# Altium project function generator.PrjPcb
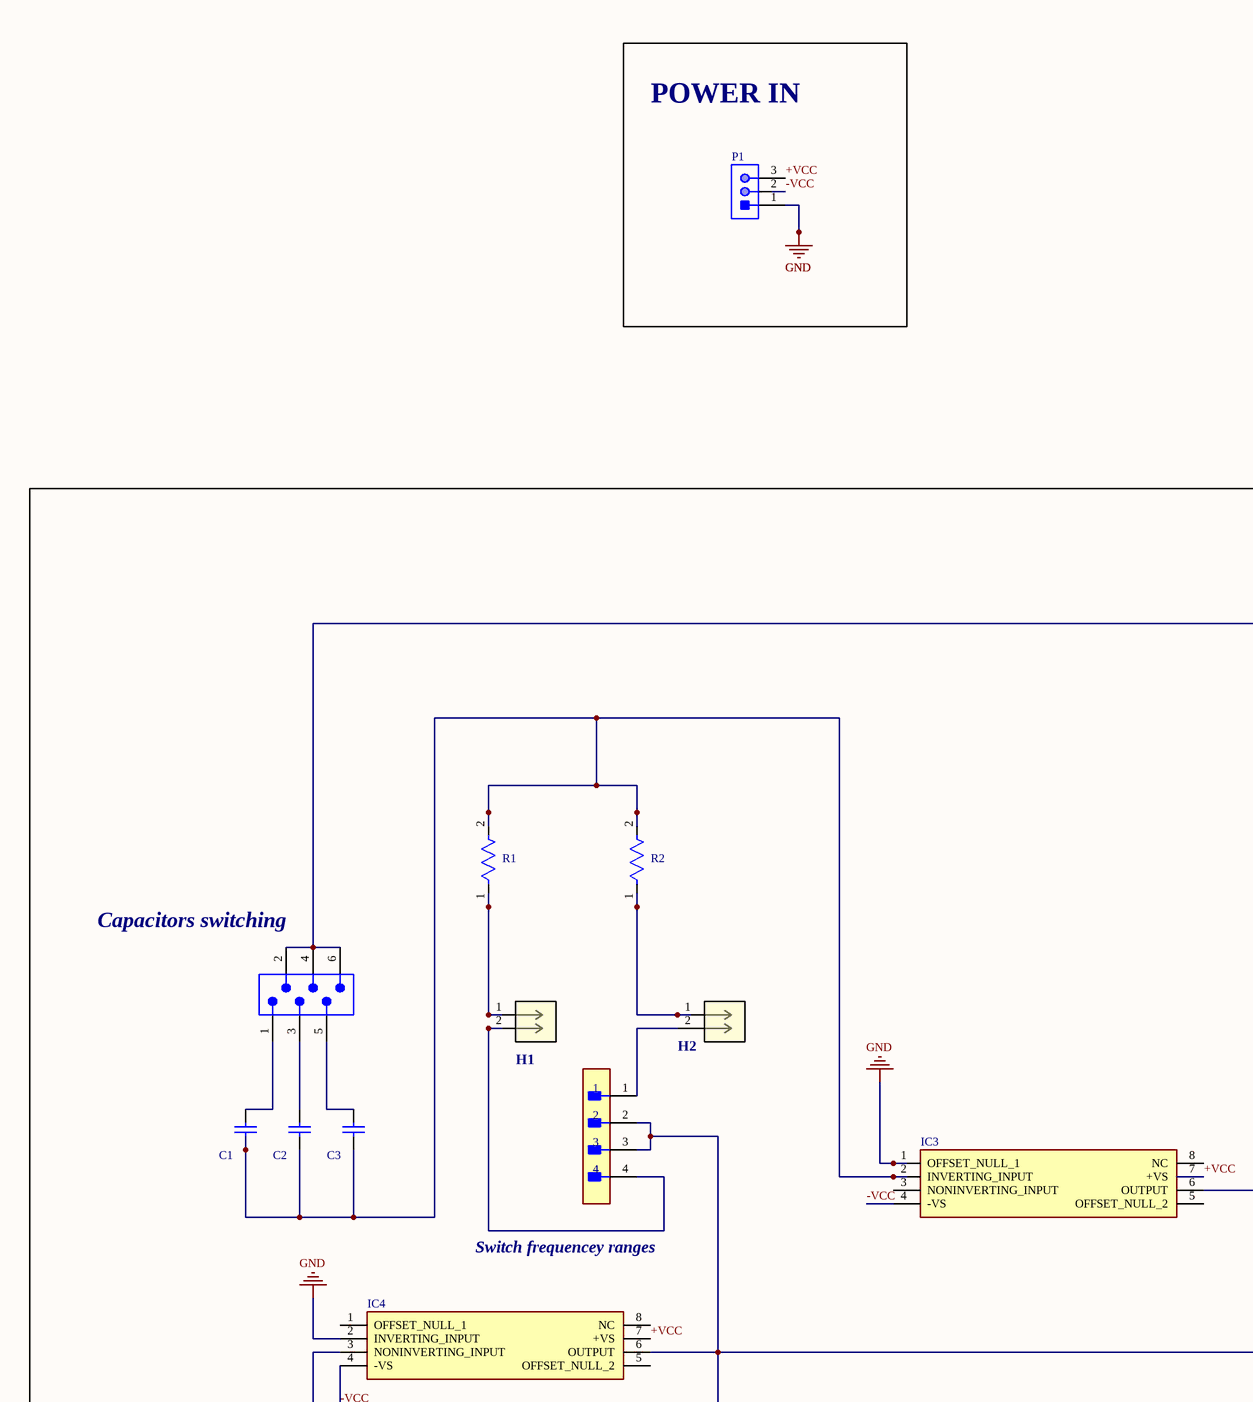
[diagram p0: FG Sce.SchDoc, top left]
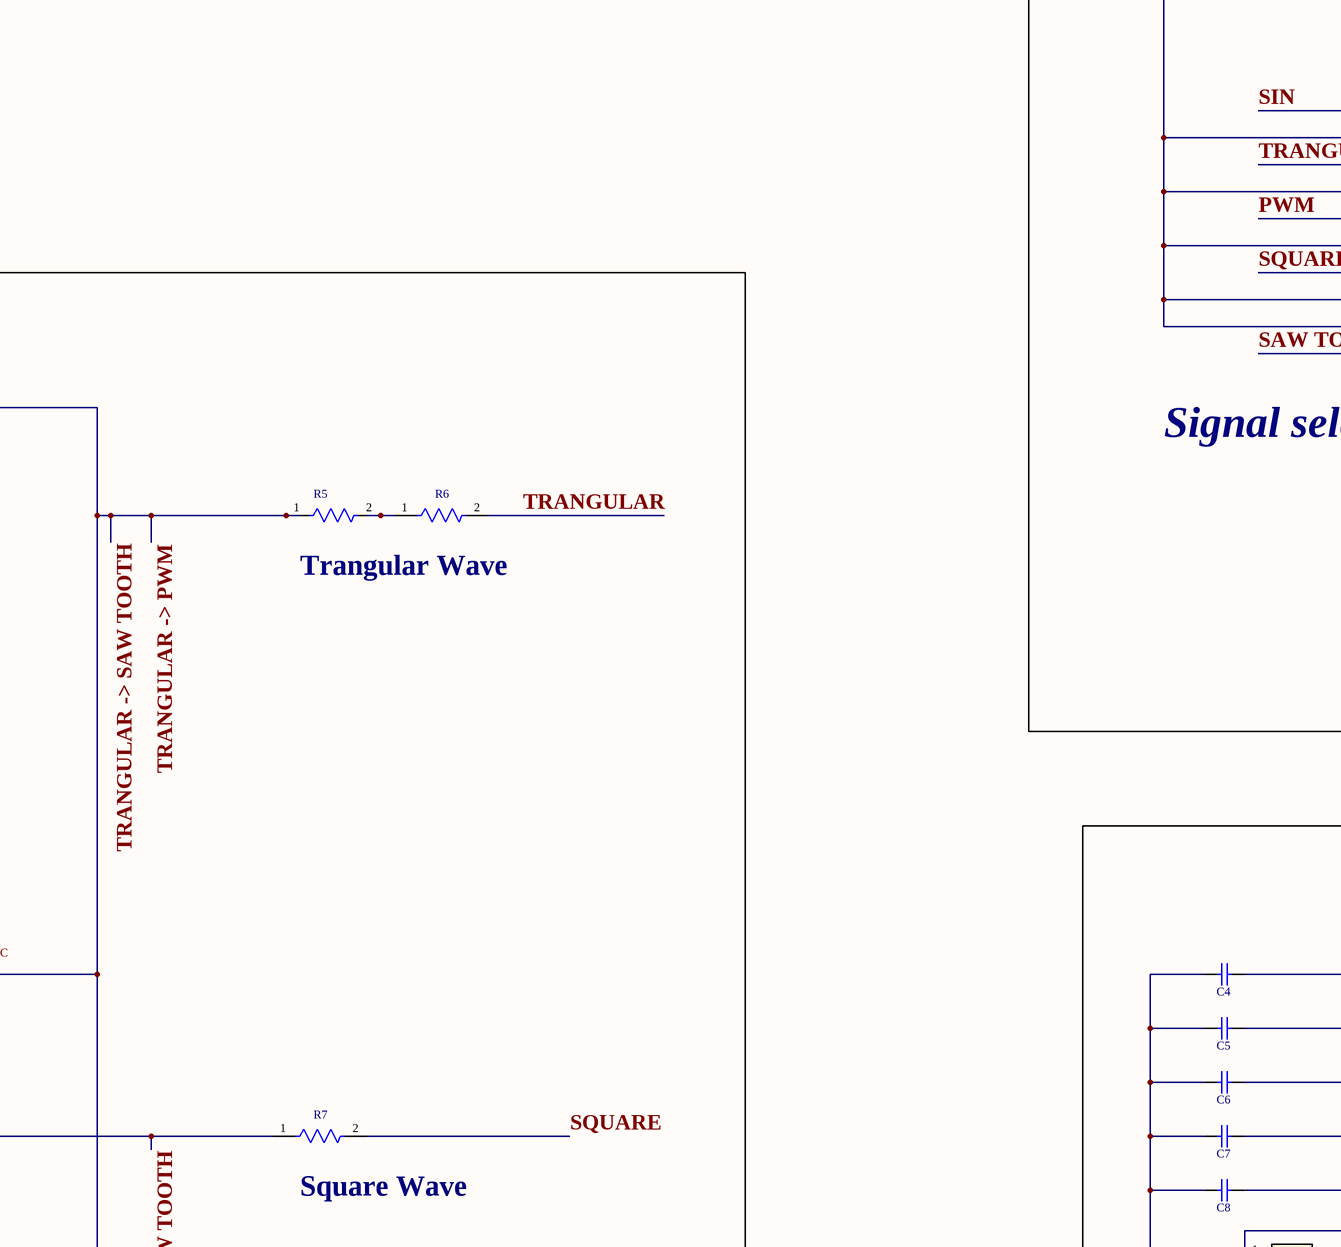
[diagram p1: FG Sce.SchDoc, top middle]
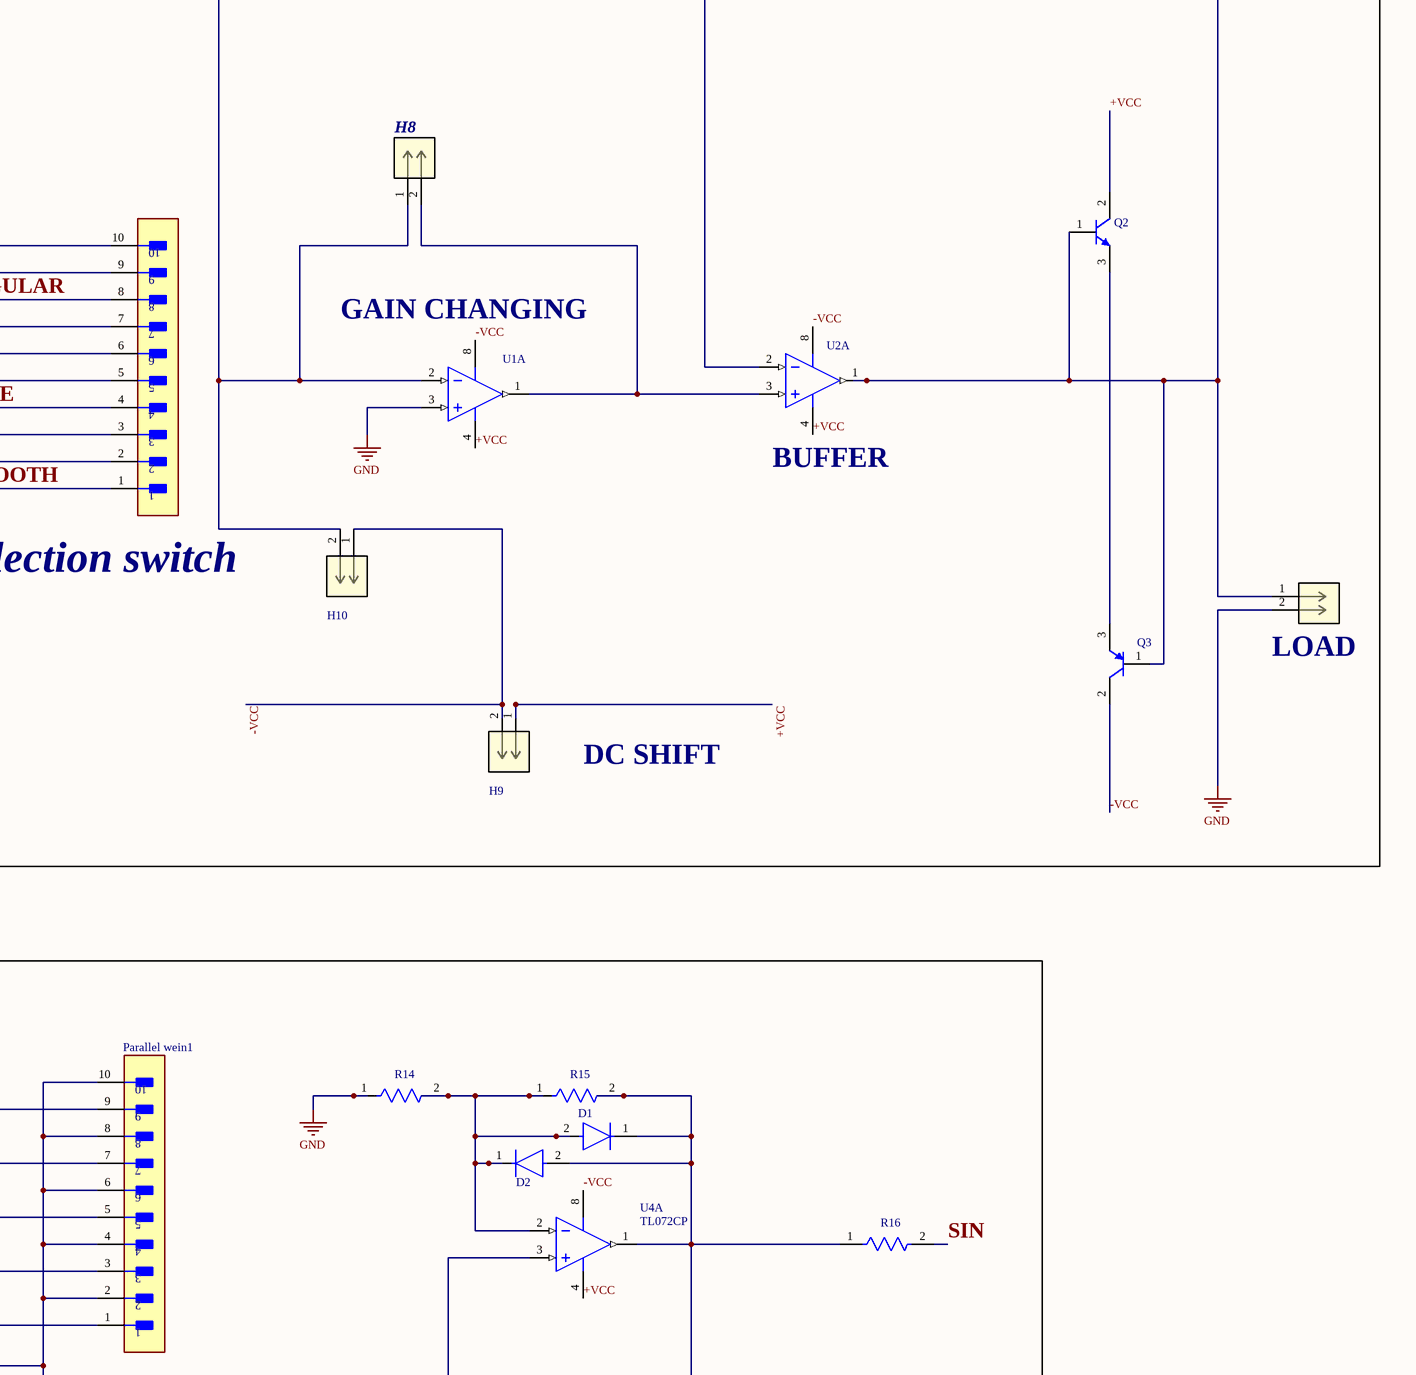
[diagram p2: FG Sce.SchDoc, top right]
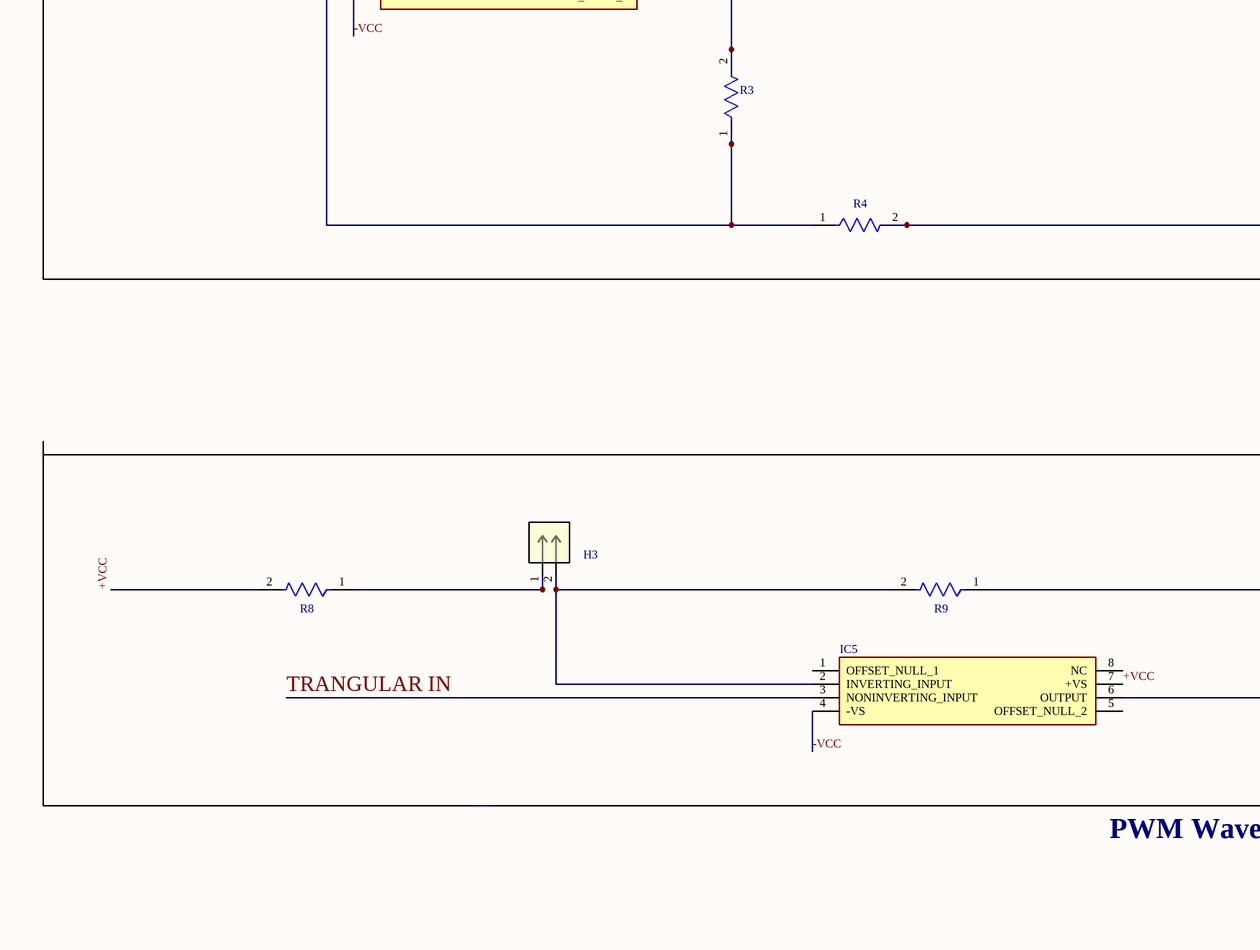
[diagram p3: FG Sce.SchDoc, bottom left]
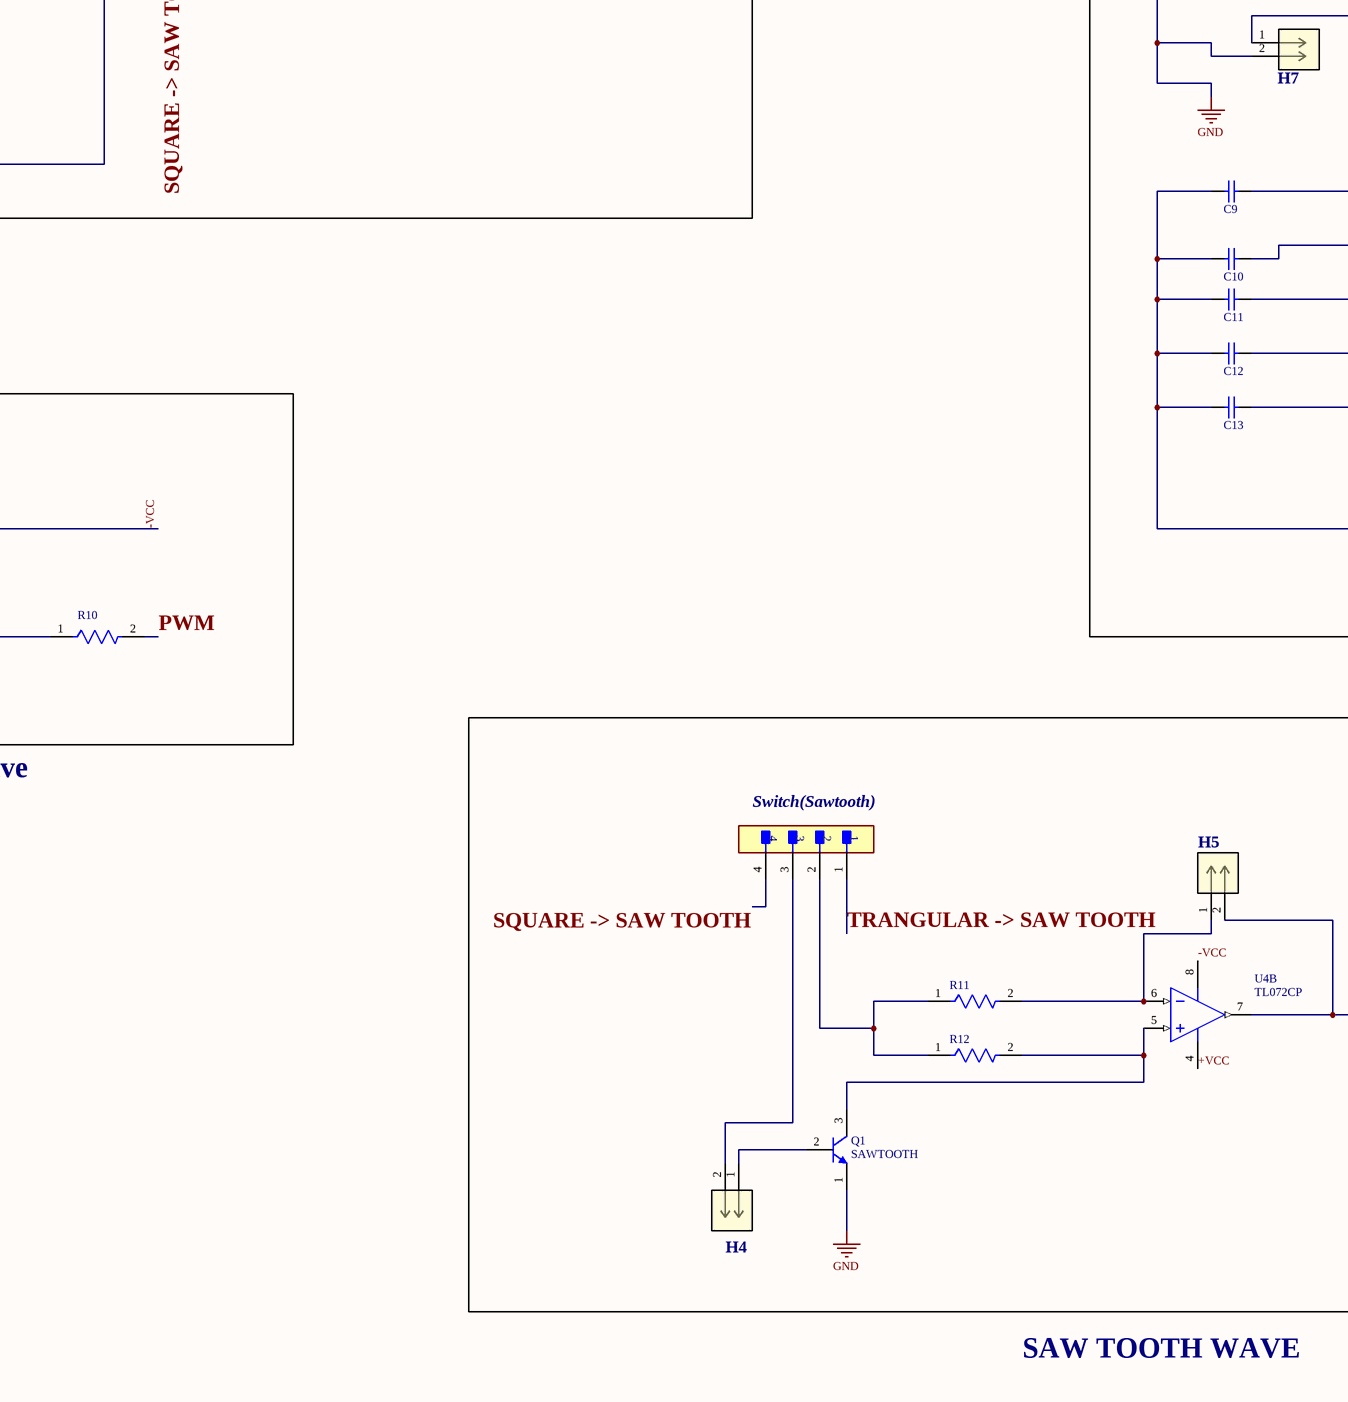
[diagram p4: FG Sce.SchDoc, bottom middle]
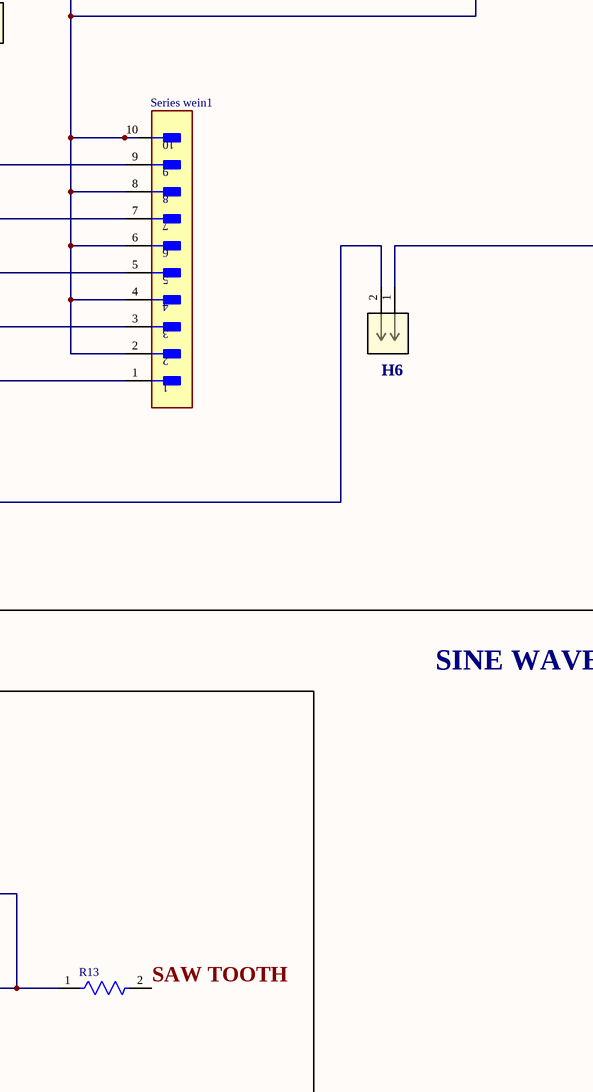
[diagram p5: FG Sce.SchDoc, bottom right]
1 sheet, 58 parts. Net scope: global (net labels, ports and power ports of the same name join across sheets).
Board file: PCB1.PcbDoc

## Sheet FG Sce.SchDoc
size A1; SheetNumber: 1; SheetTotal: 1

### Parts
C1  1uF  [KEMT-C333C105M5U5TA-2]  (value not drawn)
C2  0.1uF  [KEMT-C333C105M5U5TA-2]  (value not drawn)
C3  0.01uF  [KEMT-C333C105M5U5TA-2]  (value not drawn)
C4  10uF  [KEMT-C333C105M5U5TA-2]  (value not drawn)
C5  1uF  [KEMT-C333C105M5U5TA-2]  (value not drawn)
C6  100nF  [KEMT-C333C105M5U5TA-2]  (value not drawn)
C7  10nF  [KEMT-C333C105M5U5TA-2]  (value not drawn)
C8  1nF  [KEMT-C333C105M5U5TA-2]  (value not drawn)
C9  10uF  [KEMT-C333C105M5U5TA-2]  (value not drawn)
C10  1uF  [KEMT-C333C105M5U5TA-2]  (value not drawn)
C11  100nF  [KEMT-C333C105M5U5TA-2]  (value not drawn)
C12  10nF  [KEMT-C333C105M5U5TA-2]  (value not drawn)
C13  1nF  [KEMT-C333C105M5U5TA-2]  (value not drawn)
Capacitors_switching  690357100672  [690357100672]  (value not drawn)
D1  1N4148  [FP-017AG-MFG]  (value not drawn)
D2  1N4148  [FP-017AG-MFG]  (value not drawn)
H1  10KOHM POTENTIOMETER  [2Pins_AMP]  (value not drawn)
H2  200KOHM POTENTIOMETER  [2Pins_AMP]  (value not drawn)
H3  5Kohm Potentiometer  [2Pins_AMP]  (value not drawn)
H4  100KOHM POTENTIOMETER  [2Pins_AMP]  (value not drawn)
H5  10Kohm potentiometer  [2Pins_AMP]  (value not drawn)
H6  10Kohm potentiometer  [2Pins_AMP]  (value not drawn)
H7  10Kohm potentiometer  [2Pins_AMP]  (value not drawn)
H8  100kohm potentiometer  [2Pins_AMP]  (value not drawn)
H9  10Kohm Potentiometer  [2Pins_AMP]  (value not drawn)
H10  10Kohm Potentiometer  [2Pins_AMP]  (value not drawn)
IC3  AD711JN  [DIP794W56P254L928H457Q8N]  (value not drawn)
IC4  AD711JN  [DIP794W56P254L928H457Q8N]  (value not drawn)
IC5  AD711JN  [DIP794W56P254L928H457Q8N]  (value not drawn)
LOAD  67997-402HLF  [2Pins_AMP]  (value not drawn)
P1  292161-3  [TECO-292161-3_V]  (value not drawn)
Parallel_wein1  in 1  [FP-4-644456-0-MFG]  (value not drawn)
Q1  SAWTOOTH  [FAIR-TO-92]
Q2  TIP31A  [ONSC-TO-220-3-221A-09]  (value not drawn)
Q3  TIP32A  [ONSC-TO-220-3-221A-09]  (value not drawn)
R1  150ohm  [FP-RLR07-MFG]  (value not drawn)
R2  10K  [FP-RLR07-MFG]  (value not drawn)
R3  1K  [FP-MBB0207-MFG]  (value not drawn)
R4  150OHM  [FP-MBB0207-MFG]  (value not drawn)
R5  6.8K  [FP-MBB0207-MFG]  (value not drawn)
R6  10K  [FP-MBB0207-MFG]  (value not drawn)
R7  10K  [FP-MBB0207-MFG]  (value not drawn)
R8  10K  [FP-MBB0207-MFG]  (value not drawn)
R9  10K  [FP-MBB0207-MFG]  (value not drawn)
R10  68Kohm  [FP-MBB0207-MFG]  (value not drawn)
R11  10K  [FP-MBB0207-MFG]  (value not drawn)
R12  10K  [FP-MBB0207-MFG]  (value not drawn)
R13  10k  [FP-MBB0207-MFG]  (value not drawn)
R14  5K  [FP-MBB0207-MFG]  (value not drawn)
R15  10K  [FP-MBB0207-MFG]  (value not drawn)
R16  0.5K  [FP-MBB0207-MFG]  (value not drawn)
Series_wein1  in2  [FP-4-644456-0-MFG]  (value not drawn)
Signal_selection_switch  4-644456-0  [FP-4-644456-0-MFG]  (value not drawn)
Switch(Sawtooth)  HTSW-102-07-G-D  [FP-HTSW-102-07-G-D-MFG]  (value not drawn)
Switch_frequencey_ranges  FREQ  [FP-HTSW-102-07-G-D-MFG]  (value not drawn)
U1  TL072CP  [P0008A]  (value not drawn)  (part A of 2)
U2  TL072CP  [P0008A]  (value not drawn)  (part A of 2)
U4  TL072CP  [P0008A]  (parts A,B of 2)

### Blocks framed on the sheet
POWER IN: P1

### Nets
GND: C4.2 C5.2 C6.2 C7.2 C8.2 H7.2 IC3.1(OFFSET_NULL_1) IC4.2(INVERTING_INPUT) LOAD.2 P1.1 Q1.1(E) R14.1 U1.3(IN1+)
+VCC: H9.1 IC3.7(+VS) IC4.7(+VS) IC5.7(+VS) P1.3 Q2.2(C) R8.2 U1.4(VCC-) U2.4(VCC-) U4.4(VCC-)
-VCC: H9.2 H10.1 IC3.4(-VS) IC4.4(-VS) IC5.4(-VS) P1.2 Q3.2(C) R9.1 U1.8(VCC+) U2.8(VCC+) U4.8(VCC+)
PWM: R10.2 Signal_selection_switch.6
SAW TOOTH: R13.2 Signal_selection_switch.1
SIN: R16.2 Signal_selection_switch.10
SQUARE: R7.2 Signal_selection_switch.4
SQUARE -> SAW TOOTH: IC4.6(OUTPUT) R3.2 R7.1 Switch(Sawtooth).4 Switch_frequencey_ranges.2 Switch_frequencey_ranges.3
TRANGULAR: R6.2 Signal_selection_switch.8
TRANGULAR -> PWM: Capacitors_switching.2 Capacitors_switching.4 Capacitors_switching.6 IC3.6(OUTPUT) R4.2 R5.1 Switch(Sawtooth).1  [also labelled TRANGULAR -> SAW TOOTH]
TRANGULAR IN: IC5.3(NONINVERTING_INPUT)
NetC1_1: C1.1 C2.1 C3.1 IC3.2(INVERTING_INPUT) R1.2 R2.2
NetC1_2: C1.2 Capacitors_switching.1
NetC2_2: C2.2 Capacitors_switching.3
NetC3_2: C3.2 Capacitors_switching.5
NetC4_1: C4.1 Parallel_wein1.9
NetC5_1: C5.1 Parallel_wein1.7
NetC6_1: C6.1 Parallel_wein1.5
NetC7_1: C7.1 Parallel_wein1.3
NetC8_1: C8.1 Parallel_wein1.1
NetC9_1: C9.1 Series_wein1.9
NetC9_2: C9.2 C10.2 C11.2 C12.2 C13.2 H6.2
NetC10_1: C10.1 Series_wein1.7
NetC11_1: C11.1 Series_wein1.5
NetC12_1: C12.1 Series_wein1.3
NetC13_1: C13.1 Series_wein1.1
NetD1_1: D1.1(C) D2.2(A) H6.1 R15.2 R16.1 U4.1(OUT1)
NetD1_2: D1.2(A) D2.1(C) R14.2 R15.1 U4.2(IN1-)
NetH1_1: H1.1 R1.1
NetH1_2: H1.2 Switch_frequencey_ranges.4
NetH2_1: H2.1 R2.1
NetH2_2: H2.2 Switch_frequencey_ranges.1
NetH3_1: H3.1 R8.1
NetH3_2: H3.2 IC5.2(INVERTING_INPUT) R9.2
NetH4_1: H4.1 Q1.2(B)
NetH4_2: H4.2 Switch(Sawtooth).3
NetH5_1: H5.1 R11.2 U4.6(IN2-)
NetH5_2: H5.2 R13.1 U4.7(OUT2)
NetH7_1: H7.1 Parallel_wein1.2 Parallel_wein1.4 Parallel_wein1.6 Parallel_wein1.8 Parallel_wein1.10 Series_wein1.2 Series_wein1.4 Series_wein1.6 Series_wein1.8 Series_wein1.10 U4.3(IN1+)
NetH8_1: H8.1 H10.2 Signal_selection_switch.2 Signal_selection_switch.3 Signal_selection_switch.5 Signal_selection_switch.7 Signal_selection_switch.9 U1.2(IN1-)
NetH8_2: H8.2 U1.1(OUT1) U2.3(IN1+)
NetIC4_3: IC4.3(NONINVERTING_INPUT) R3.1 R4.1
NetIC5_6: IC5.6(OUTPUT) R10.1
NetLOAD_1: LOAD.1 Q2.1(B) Q3.1(B) U2.1(OUT1) U2.2(IN1-)
NetQ1_3: Q1.3(C) R12.2 U4.5(IN2+)
NetQ2_3: Q2.3(E) Q3.3(E)
NetR5_2: R5.2 R6.1
NetR11_1: R11.1 R12.1 Switch(Sawtooth).2

Not connected (* = marked no-connect by the designer): IC3 3(NONINVERTING_INPUT) 5(OFFSET_NULL_2) 8(NC); IC4 1(OFFSET_NULL_1) 5(OFFSET_NULL_2) 8(NC); IC5 1(OFFSET_NULL_1) 5(OFFSET_NULL_2) 8(NC)

### Notes on the sheet
- (near U1) GAIN CHANGING
- (near U2) BUFFER
- Trangular Wave
- DC SHIFT
- (near R7) Square Wave
- SINE WAVE
- PWM Wave
- SAW TOOTH WAVE

### Library data of the parts
C1 C5 C10 = CMP-2000-05174-1: Multilayer Ceramic Capacitor / Axial and Radial Leaded, 1 uF, +/- 20%, 10 to 85 degC, 2-Pin THD, RoHS, Bulk; Manufacturer: Kemet; Voltage Rating: 50V; Temperature Coefficient / Code: Z5U; Case Height: 3.81mm; Lead Diameter: 0.51mm; Case Style: ConformallyCoated; Dissipation Factor DF: 4; Case Length: 9.91mm; Type: RadialLeads; Case Width: 7.62mm; Dimensions: 7.62mmWx9.91mmLx3.81mmH; Termination Style: Radial; Factory Pack Quantity: 250; Packaging: Bulk; RoHS: Details; Datasheet Version: Jul-09; Lead Spacing: 5.08mm; Product Category: MultilayerCeramicCapacitorsMLCC-Leaded; Maximum Operating Temperature: +125C; Product: GeneralTypeMLCCs; Manufacturer URL: http://www.kemet.com/; Capacitance: 1uF; Lead Style: InsideBend; Operating Temperature Range: -55Cto+125C; Datasheet URL: http://www.farnell.com/datasheets/706880.pdf; Voltage Rating DC: 50V; Brand: Kemet; Series: C333; Tolerance: 20%; Minimum Operating Temperature: -55C
C2-C4 C6-C9 C11-C13 = CMP-2000-05174-1: Multilayer Ceramic Capacitor / Axial and Radial Leaded, 1 uF, +/- 20%, 10 to 85 degC, 2-Pin THD, RoHS, Bulk; Manufacturer: Kemet; Voltage Rating: 50V; Temperature Coefficient / Code: Z5U; Case Height: 3.81mm; Lead Diameter: 0.51mm; Case Style: ConformallyCoated; Dissipation Factor DF: 4; Capacitance: 1uF; Case Length: 9.91mm; Type: RadialLeads; Case Width: 7.62mm; Dimensions: 7.62mmWx9.91mmLx3.81mmH; Termination Style: Radial; Factory Pack Quantity: 250; Packaging: Bulk; RoHS: Details; Datasheet Version: Jul-09; Lead Spacing: 5.08mm; Product Category: MultilayerCeramicCapacitorsMLCC-Leaded; Maximum Operating Temperature: +125C; Product: GeneralTypeMLCCs; Manufacturer URL: http://www.kemet.com/; Lead Style: InsideBend; Operating Temperature Range: -55Cto+125C; Datasheet URL: http://www.farnell.com/datasheets/706880.pdf; Voltage Rating DC: 50V; Brand: Kemet; Series: C333; Tolerance: 20%; Minimum Operating Temperature: -55C
Capacitors_switching = CMP-1502-00902-2: NexarPartId: 8917654; Contact Resistance: 10mΩ; Number of Positions: 6; Gender: Male; Row Spacing: 2.54mm; Current Rating: 1.5A; Connector Type: Male Pin; Insulation: Insulated; Insulation Resistance: 1GΩ; Voltage Rating: 100V; Length: 9.65mm; Mount: Through Hole; Lead Pitch: 2.54mm; Orientation: Straight; Min Operating Temperature: -40°C; Max Operating Temperature: 105°C; Insulation Material: PBT; Termination: Through Hole; REACH SVHC: Unknown; Pitch: 2.54mm; Number of Rows: 2; Color: Red; Contact Plating: Tin; Flammability Rating: UL94 V-0; Housing Material: PBT; Number of Pins: 6; Contact Material: Bronze; Number of Contacts: 6; RoHS: Compliant; Contact Gender: Male; Operating Supply Voltage: 100V; Height: 7mm
D1 D2 = CMP-07163-000046-1: DIODE GEN PURP 100V 200MA DO35; Forward Voltage: 1V; Max Power Dissipation: 500mW; Max Reverse Current: 5uA; Forward Current: 300mA; Current: 4A; Reverse Recovery Time: 4ns; Element Configuration: Single; Outside Diameter: 1.85mm; Capacitance: 4pF; Polarity: Standard; Max Forward Surge Current (Ifsm): 1A; Reverse Voltage: 100V; Output Current: 200mA; Average Rectified Current: 200mA; Diameter: 1.91mm; Max Repetitive Reverse Voltage (Vrrm): 100V; Current Rating: 200mA; Case/Package: DO-35; Lead Free: Lead Free; Number of Pins: 2; Recovery Time: 4ns; Packaging: Bulk; Contact Plating: Tin; Voltage: 100V; Mount: Through Hole; Max Surge Current: 4A; Package Quantity: 2000; Width: 1.91mm; Max Reverse Voltage (DC): 100V; Length: 4.56mm; Radiation Hardening: No; Power Dissipation: 500mW; Voltage Rating (DC): 100V; Peak Non-Repetitive Surge Current: 4A; REACH SVHC: No SVHC; Height: 4.56mm; Max Operating Temperature: 175°C; Series: -; Weight: 0.01lb; Min Operating Temperature: -65°C
H1-H10 LOAD = 67997-402HLF: No Description Available; Mfr_Name: Amphenol ICC; RefDes: RefDes; Type: Type
IC3-IC5 = AD711JN: Integrated Circuit; Manufacturer_Name: Analog Devices; Datasheet Link: https://www.analog.com/media/en/technical-documentation/data-sheets/AD711.pdf; Height: 4.57mm; Manufacturer_Part_Number: AD711JN
P1 = CMP-2000-05551-1: Male Header, Pitch 2 mm, 1 x 3 Position, Height 6.8 mm, Tail Length 3.2 mm, -40 to 105 degC, RoHS, Bulk; Manufacturer: TE Connectivity; SVHC: NoSVHC(15-Jun-2015); Pitch Spacing: 2mm; Contact Termination Type: ThroughHole; No. of Rows: 1Rows; No. of Contacts: 3Contacts; Product Range: AMPCTSeries; Mounting Technology: ThroughHole; Manufacturer URL: http://www.te.com/; Contact Material: Brass; Datasheet URL: http://www.te.com/commerce/DocumentDelivery/DDEController?Action=showdoc&DocId=Customer+Drawing%7F292161%7FP1%7Fpdf%7FEnglish%7FENG_CD_292161_P1.pdf%7F292161-3; Package Reference: 292161-3; Contact Plating: TinPlatedContacts; Gender: Header; Datasheet Version: Rev. P1, 06/2016; Package Description: Male Header, Pitch 2 mm, 1 x 3 Position, Height 6.8 mm, Tail Length 3.2 mm
Parallel_wein1 Series_wein1 = CMP-03369-000038-1: CONN HEADER VERT 10POS 2.54MM; Manufacturer Part Number: 4-644456-0; Manufacturer: TE Connectivity; Current Rating: 5A; Conn Gender: Male; Number Of Contacts: 10; Conn Orientation: Vertical; Voltage Rating: 250V; Number Of Rows: 1; Device Class L3: unset; Octopart: https://octopart.com/4-644456-0-te+connectivity-39514173; Pitch: 2.54mm; Mouser Description: Headers & Wire Housings NARROW FLT HDR 10P Straight Post; ComponentLink2Description: Datasheet; Height: 0.408inch; Package: 4-644456-0; RoHS: TRUE; Temperature Range High: +105°C; Digikey Description: CONN HEADER VERT 10POS 2.54MM; Temperature: -55°C to +105°C; Device Class L2: Headers and Wire Housings; Automotive: No; Lead Free: Yes; Contact Material: Tin; Temperature Range Low: -55°C; Footprint Url: https://www.te.com/commerce/DocumentDelivery/DDEController?Action=showdoc&DocId=Customer+Drawing%7F644456%7FD2%7Fpdf%7FEnglish%7FENG_CD_644456_D2.pdf%7F4-644456-0; Device Class L1: Connectors; Category: Conn; ComponentLink2URL: https://www.te.com/commerce/DocumentDelivery/DDEController?Action=showdoc&DocId=Data+Sheet%7F82056_MTA%7F0818%7Fpdf%7FEnglish%7FENG_DS_82056_MTA_0818.pdf%7F4-644456-0
Q1 = CMP-2000-04944-1: NPN General-Purpose Amplifier, 40 V VCEO, 0.2 A, -55 to 150 degC, 2-Pin TO-92, RoHS, Bulk; Manufacturer: FairchildSemiconductor; Maximum Collector Base Voltage: 60V; Minimum DC Current Gain: 40@0.1mA@1V; Maximum Collector Emitter Voltage: 40V; Maximum DC Collector Current: 0.2A; Rad Hard: No; Maximum Operating Frequency: 300(Min)MHz; Maximum Collector Emitter Saturation Voltage: 0.2@1mA@10mA; Maximum Power Dissipation: 625mW; Package Description: 3-Pin Transistor Outline Package, Body Dia 4.79 mm, Pitch 1.27 mm; Package Reference: TO-92; Pin Count: 3; Operating Temperature: -55to150degC; Category: GPBJT; Manufacturer URL: https://www.fairchildsemi.com/; Datasheet URL: https://datasheet.ciiva.com/4722/2n3904-82270-4722369.pdf; Package: 3TO-92; Packaging: Bulk; Type: NPN; Datasheet Version: Rev. 1.1.0, 10/2014; Mounting: ThroughHole
Q2 = CMP-1048-01124-1: Complementary Silicon Plastic Power Transistor, 3-Pin TO-220, Tube; Manufacturer: On Semiconductor; IC Continuous (A): 3; Polarity: NPN; ComponentLink2Description: Datasheet; Mounting Technology: Through Hole; DatasheetVersion: Rev. 14; ComponentLink1URL: http://www.onsemi.com/; PackageReference: TO-220-3-221A-09; ComponentLink3URL: http://www.onsemi.com/pub_link/Collateral/221A-09.PDF; Packing: Tube; PartNumber: TIP31A; ComponentLink3Description: Package Specification; ComponentLink1Description: Manufacturer URL; PackageVersion: Rev. AG, 09/2011; ComponentLink2URL: http://www.onsemi.com/pub_link/Collateral/TIP31A-D.PDF; PackageDescription: 3-Pin Flange Mount, Vertical Straight Lead, Body 9.97 x 4.445 mm, Pitch 2.54 mm; fT Min (MHz): 3; RoHS: FALSE
Q3 = CMP-1048-01079-1: Complementary Silicon Plastic Power Transistor, 3-Pin TO-220, Tube; Manufacturer: On Semiconductor; Polarity: PNP; IC Continuous (A): 3; ComponentLink3Description: Package Specification; ComponentLink2URL: http://www.onsemi.com/pub_link/Collateral/TIP31A-D.PDF; PackageDescription: 3-Pin Flange Mount, Vertical Straight Lead, Body 9.97 x 4.445 mm, Pitch 2.54 mm; PackageVersion: Rev. AG, 09/2011; Mounting Technology: Through Hole; RoHS: FALSE; ComponentLink1URL: http://www.onsemi.com/; ComponentLink2Description: Datasheet; PackageReference: TO-220-3-221A-09; fT Min (MHz): 3; ComponentLink1Description: Manufacturer URL; PartNumber: TIP32A; DatasheetVersion: Rev. 14; Packing: Tube; ComponentLink3URL: http://www.onsemi.com/pub_link/Collateral/221A-09.PDF
R1 R2 = CMP-00030-41139779-1: RLR07C7501GSB14 Res Metal Film 7.5K Ohm 2% 1/4W ±100ppm/°C 0.001% Conformal AXL Thru-Hole Bulk; Resistance: 7.5kΩ; Voltage Rating: 250V; Power Rating: 250mW; Military Standard: MIL-PRF-39017; Tolerance: 2%; Width: 2.29mm; Case/Package: Axial; Failure Rate: 0.001%; Composition: Metal Film; Height: 2.5mm; Max Operating Temperature: 150°C; Termination: Axial; Schedule B: 8533210090, 8533210090; Number of Terminations: 2; Voltage Rating (DC): 250V; RoHS: Non-Compliant; Mount: Through Hole; Packaging: Bulk; Features: Military, Moisture Resistant, Weldable; Min Operating Temperature: -65°C; Length: 7.62mm; Diameter: 2.29mm; Lead Free: Contains Lead; Max Power Dissipation: 250mW; Temperature Coefficient: 100ppm/°C; Contact Plating: Lead, Tin; NexarPartId: 41139779
R3-R16 = CMP-02408-000035-1: RES 10K OHM 0.6W 1% AXIAL; Voltage Rating: 300V; Resistance: 10kR; Max Power Dissipation: 600mW; Temperature Coefficient: 50ppm/°C; Radiation Hardening: No; Case/Package: Conformal; Termination: Axial; Military Standard: Not; Length: 6.5mm; Voltage Rating (DC): 300V; RoHS Compliant: Yes; Number of Terminations: 2; Packaging: Tape and Reel; Features: Automotive AEC-Q200; Tolerance: 1%; Min Operating Temperature: -55°C; Power Rating: 600mW; Lead Free: Lead Free; Resistor Type: Metal Film; Construction: Cylindrical; Series: MBB 0207 - Professional; Max Operating Temperature: 155°C; Diameter: 2.5mm; Resistance Tolerance: 1%; Contact Plating: Tin; Technology: THIN FILM
Signal_selection_switch = CMP-03369-000038-1: CONN HEADER VERT 10POS 2.54MM; Manufacturer: TE Connectivity; Current Rating: 5A; Conn Gender: Male; Number Of Contacts: 10; Conn Orientation: Vertical; Voltage Rating: 250V; Number Of Rows: 1; Device Class L3: unset; Octopart: https://octopart.com/4-644456-0-te+connectivity-39514173; Pitch: 2.54mm; Mouser Description: Headers & Wire Housings NARROW FLT HDR 10P Straight Post; ComponentLink2Description: Datasheet; Height: 0.408inch; Package: 4-644456-0; RoHS: TRUE; Temperature Range High: +105°C; Digikey Description: CONN HEADER VERT 10POS 2.54MM; Temperature: -55°C to +105°C; Device Class L2: Headers and Wire Housings; Automotive: No; Lead Free: Yes; Contact Material: Tin; Manufacturer Part Number: 4-644456-0; Temperature Range Low: -55°C; Footprint Url: https://www.te.com/commerce/DocumentDelivery/DDEController?Action=showdoc&DocId=Customer+Drawing%7F644456%7FD2%7Fpdf%7FEnglish%7FENG_CD_644456_D2.pdf%7F4-644456-0; Device Class L1: Connectors; Category: Conn; ComponentLink2URL: https://www.te.com/commerce/DocumentDelivery/DDEController?Action=showdoc&DocId=Data+Sheet%7F82056_MTA%7F0818%7Fpdf%7FEnglish%7FENG_DS_82056_MTA_0818.pdf%7F4-644456-0
Switch(Sawtooth) = CMP-02766-000010-1: CONN HEADER VERT 4POS 2.54MM; Manufacturer: Samtec; Voltage Rating: 550V; Conn Orientation: Straight; Number Of Contacts: 4; Conn Gender: Male; Current Rating: 6.3A; Number Of Rows: 2; Category: Conn; Temperature: -55°C to +125°C; Automotive: No; Digikey Description: CONN HEADER VERT 4POS 2.54MM; ComponentLink2URL: http://suddendocs.samtec.com/catalog_english/htsw_th.pdf; Device Class L2: Headers and Wire Housings; Mouser Description: Conn Unshrouded Header HDR 4 POS 2.54mm Solder ST Thru-Hole Bag; Manufacturer Part Number: HTSW-102-07-G-D; Temperature Range High: +125°C; Contact Material: Gold,Nickel; Temperature Range Low: -55°C; ComponentLink2Description: Datasheet; Device Class L1: Connectors; Pitch: 2.54mm; Octopart: https://octopart.com/htsw-102-07-g-d-samtec-10531767; RoHS: TRUE; Package: HTSW-102-07-G-D; Lead Free: Yes; Device Class L3: unset; Height: 8.71mm
Switch_frequencey_ranges = CMP-02766-000010-1: CONN HEADER VERT 4POS 2.54MM; Manufacturer: Samtec; Manufacturer Part Number: HTSW-102-07-G-D; Voltage Rating: 550V; Conn Orientation: Straight; Number Of Contacts: 4; Conn Gender: Male; Current Rating: 6.3A; Number Of Rows: 2; Category: Conn; Temperature: -55°C to +125°C; Automotive: No; Digikey Description: CONN HEADER VERT 4POS 2.54MM; ComponentLink2URL: http://suddendocs.samtec.com/catalog_english/htsw_th.pdf; Device Class L2: Headers and Wire Housings; Mouser Description: Conn Unshrouded Header HDR 4 POS 2.54mm Solder ST Thru-Hole Bag; Temperature Range High: +125°C; Contact Material: Gold,Nickel; Temperature Range Low: -55°C; ComponentLink2Description: Datasheet; Device Class L1: Connectors; Pitch: 2.54mm; Octopart: https://octopart.com/htsw-102-07-g-d-samtec-10531767; RoHS: TRUE; Package: HTSW-102-07-G-D; Lead Free: Yes; Device Class L3: unset; Height: 8.71mm
U1 U2 U4 = CMP-0017-00950-2: Dual Low-Noise JFET-Input General-Purpose Operational Amplifier, 7 to 36 V, 0 to 70 degC, 8-pin DIP (P8), Pb-Free (RoHS); Manufacturer: Texas Instruments; Sub Family: General Purpose Amplifier, High Supply Voltage Amplifier (>=30V); Total Supply Voltage(Max)(+5V is 5, +/-5V is 10): 36; Slew Rate(Typ)(V/us): 13; Vn at 1kHz(Typ)(nV/rtHz): 18; GBW(Typ)(MHz): 3; CMRR(Min)(dB): 70; Total Supply Voltage(Min)(+5V is 5, +/-5V is 10): 7; Vio (25C)(Max)(mV): 10; Rating: Catalog; IIB(Max)(pA): 200; Iq per channel(Max)(mA): 2.5; Number of Channels: 2; Mounting Technology: Through Hole; ComponentLink3Description: Package Specification; PartNumber: TL072CP; PackageVersion: 4040082/E, 04/2010; Eco-Plan: Pb-Free (RoHS); DatasheetVersion: SLOS080J; Offset Drift(Typ)(uV/C): 18; ComponentLink3URL: http://www.ti.com/litv/pdf/mpdi001b; PackageDescription: 8-Pin Plastic In-Line, Body 9.59 x 6.35 mm, Pitch 2.54 mm; Code_JEDEC: MS-001; ComponentLink2URL: http://www.ti.com/lit/ds/symlink/tl072.pdf; ComponentLink1Description: Manufacturer URL; ComponentLink2Description: Datasheet; ComponentLink1URL: http://www.ti.com/; PackageReference: P0008A